# EAGLE schematic LEVEL_TRANSLATOR (EAGLE 7.7.0)
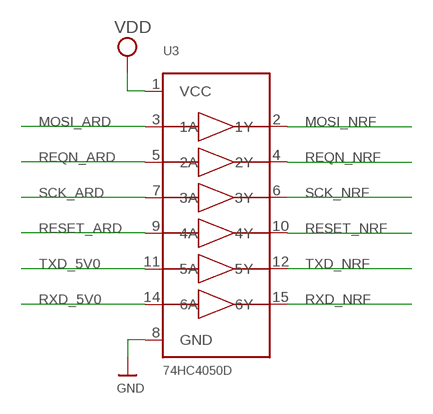
[diagram p0: schematic, sheet 1]

## Parts
U3  74HC4050D  74HC4050DTSSOP  [TSSOP16]

## Nets
GND: U3.8(GND)
MOSI_ARD: U3.3(1A)
MOSI_NRF: U3.2(1Y)
REQN_ARD: U3.5(2A)
REQN_NRF: U3.4(2Y)
RESET_ARD: U3.9(4A)
RESET_NRF: U3.10(4Y)
RXD_5V0: U3.14(6A)
RXD_NRF: U3.15(6Y)
SCK_ARD: U3.7(3A)
SCK_NRF: U3.6(3Y)
TXD_5V0: U3.11(5A)
TXD_NRF: U3.12(5Y)
VDD: U3.1(VCC)

## Library data of the parts
U3 = microbuilder:74HC4050D: 6-channel level shifter 74HC4050D - 2V-6V Supply SOIC16 Digikey: 74HC4050D,653-ND Mouser: 771-74HC4050D-T TSSOP16 Digikey: 296-9215-1-ND Mouser: